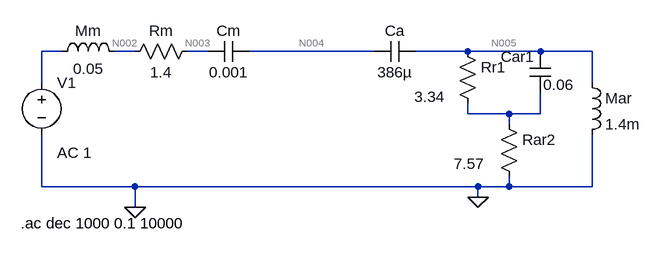
[diagram p0: schematic EA_EX7_PistaoCaixaSelada_Referenciado.asc]
EA_EX7_PistaoCaixaSelada_Referenciado.asc, the LTspice schematic file:
Version 4
SHEET 1 888 680
WIRE -32 64 -64 64
WIRE 80 64 48 64
WIRE 192 64 160 64
WIRE 448 64 256 64
WIRE 592 64 512 64
WIRE 704 64 592 64
WIRE 784 64 704 64
WIRE -64 112 -64 64
WIRE 784 112 784 64
WIRE 592 160 592 144
WIRE 656 160 592 160
WIRE 704 160 704 128
WIRE 704 160 656 160
WIRE 656 176 656 160
WIRE -64 272 -64 192
WIRE 80 272 -64 272
WIRE 608 272 80 272
WIRE 656 272 656 256
WIRE 656 272 608 272
WIRE 784 272 784 192
WIRE 784 272 656 272
WIRE 608 288 608 272
WIRE 80 304 80 272
FLAG 80 304 0
FLAG 608 288 0
SYMBOL voltage -64 96 R0
WINDOW 123 24 124 Left 2
WINDOW 39 0 0 Left 0
SYMATTR Value2 AC 1
SYMATTR InstName V1
SYMATTR Value ""
SYMBOL ind -48 80 R270
WINDOW 0 32 56 VTop 2
WINDOW 3 5 56 VBottom 2
SYMATTR InstName Mm
SYMATTR Value 0.05
SYMBOL res 176 48 R90
WINDOW 0 0 56 VBottom 2
WINDOW 3 32 56 VTop 2
SYMATTR InstName Rm
SYMATTR Value 1.4
SYMBOL cap 256 48 R90
WINDOW 0 0 32 VBottom 2
WINDOW 3 32 32 VTop 2
SYMATTR InstName Cm
SYMATTR Value 0.001
SYMBOL cap 512 48 R90
WINDOW 0 0 32 VBottom 2
WINDOW 3 32 32 VTop 2
SYMATTR InstName Ca
SYMATTR Value 386µ
SYMBOL cap 720 128 R180
WINDOW 0 24 56 Left 2
WINDOW 3 -36 13 Left 2
SYMATTR InstName Car1
SYMATTR Value 0.06
SYMBOL ind 768 96 R0
SYMATTR InstName Mar
SYMATTR Value 1.4m
SYMBOL res 576 48 R0
WINDOW 3 -66 86 Left 2
SYMATTR Value 3.34
SYMATTR InstName Rr1
SYMBOL res 640 160 R0
WINDOW 3 -69 77 Left 2
SYMATTR Value 7.57
SYMATTR InstName Rar2
TEXT -96 328 Left 2 !.ac dec 1000 0.1 10000

The netlist it stands for:
* EA_EX7_PistaoCaixaSelada_Referenciado.asc
V1 N001 0 AC 1
L§Mm N001 N002 0.05
Rm N003 N002 1.4
Cm N004 N003 0.001
Ca N005 N004 386µ
Car1 N006 N005 0.06
L§Mar N005 0 1.4m
Rr1 N005 N006 3.34
Rar2 N006 0 7.57
.ac dec 1000 0.1 10000
.backanno
.end

* Results of the author's LTspice run, read from the files saved beside the schematic
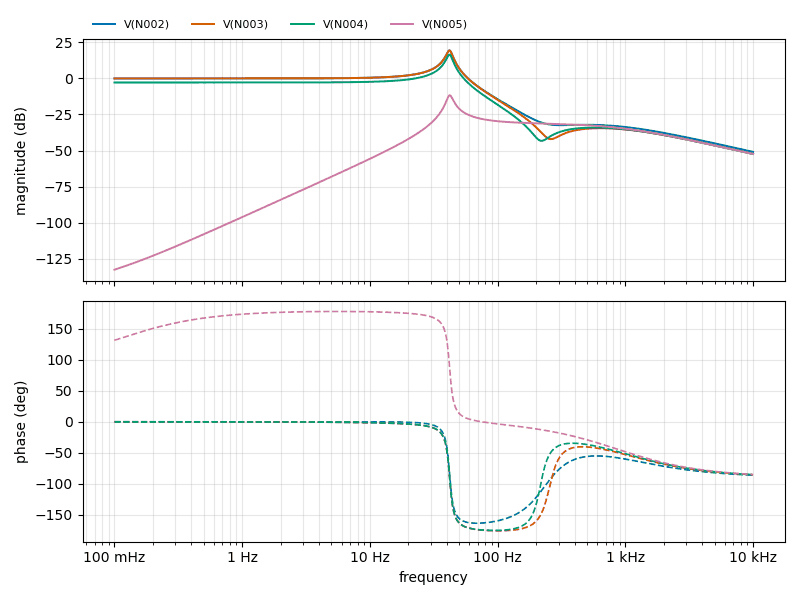
[diagram p1: AC Analysis of EA_EX7_PistaoCaixaSelada_Referenciado.asc, plotted from the saved traces]
* AC Analysis, 1 run:
*   V(N002): 0.00 dB at 100 mHz, -50.92 dB at 10 kHz, peak 19.44 dB at 41.98 Hz, 3 dB below the peak at 39.68 Hz and 44.09 Hz
*   V(N003): 0.00 dB at 100 mHz, -52.40 dB at 10 kHz, peak 19.39 dB at 41.98 Hz, 3 dB below the peak at 39.67 Hz and 44.08 Hz
*   V(N004): -2.84 dB at 100 mHz, -52.40 dB at 10 kHz, peak 16.46 dB at 41.98 Hz, 3 dB below the peak at 39.67 Hz and 44.08 Hz
*   V(N005): -132.65 dB at 100 mHz, -52.39 dB at 10 kHz, peak -11.68 dB at 42.17 Hz, 3 dB below the peak at 40.13 Hz and 44.58 Hz